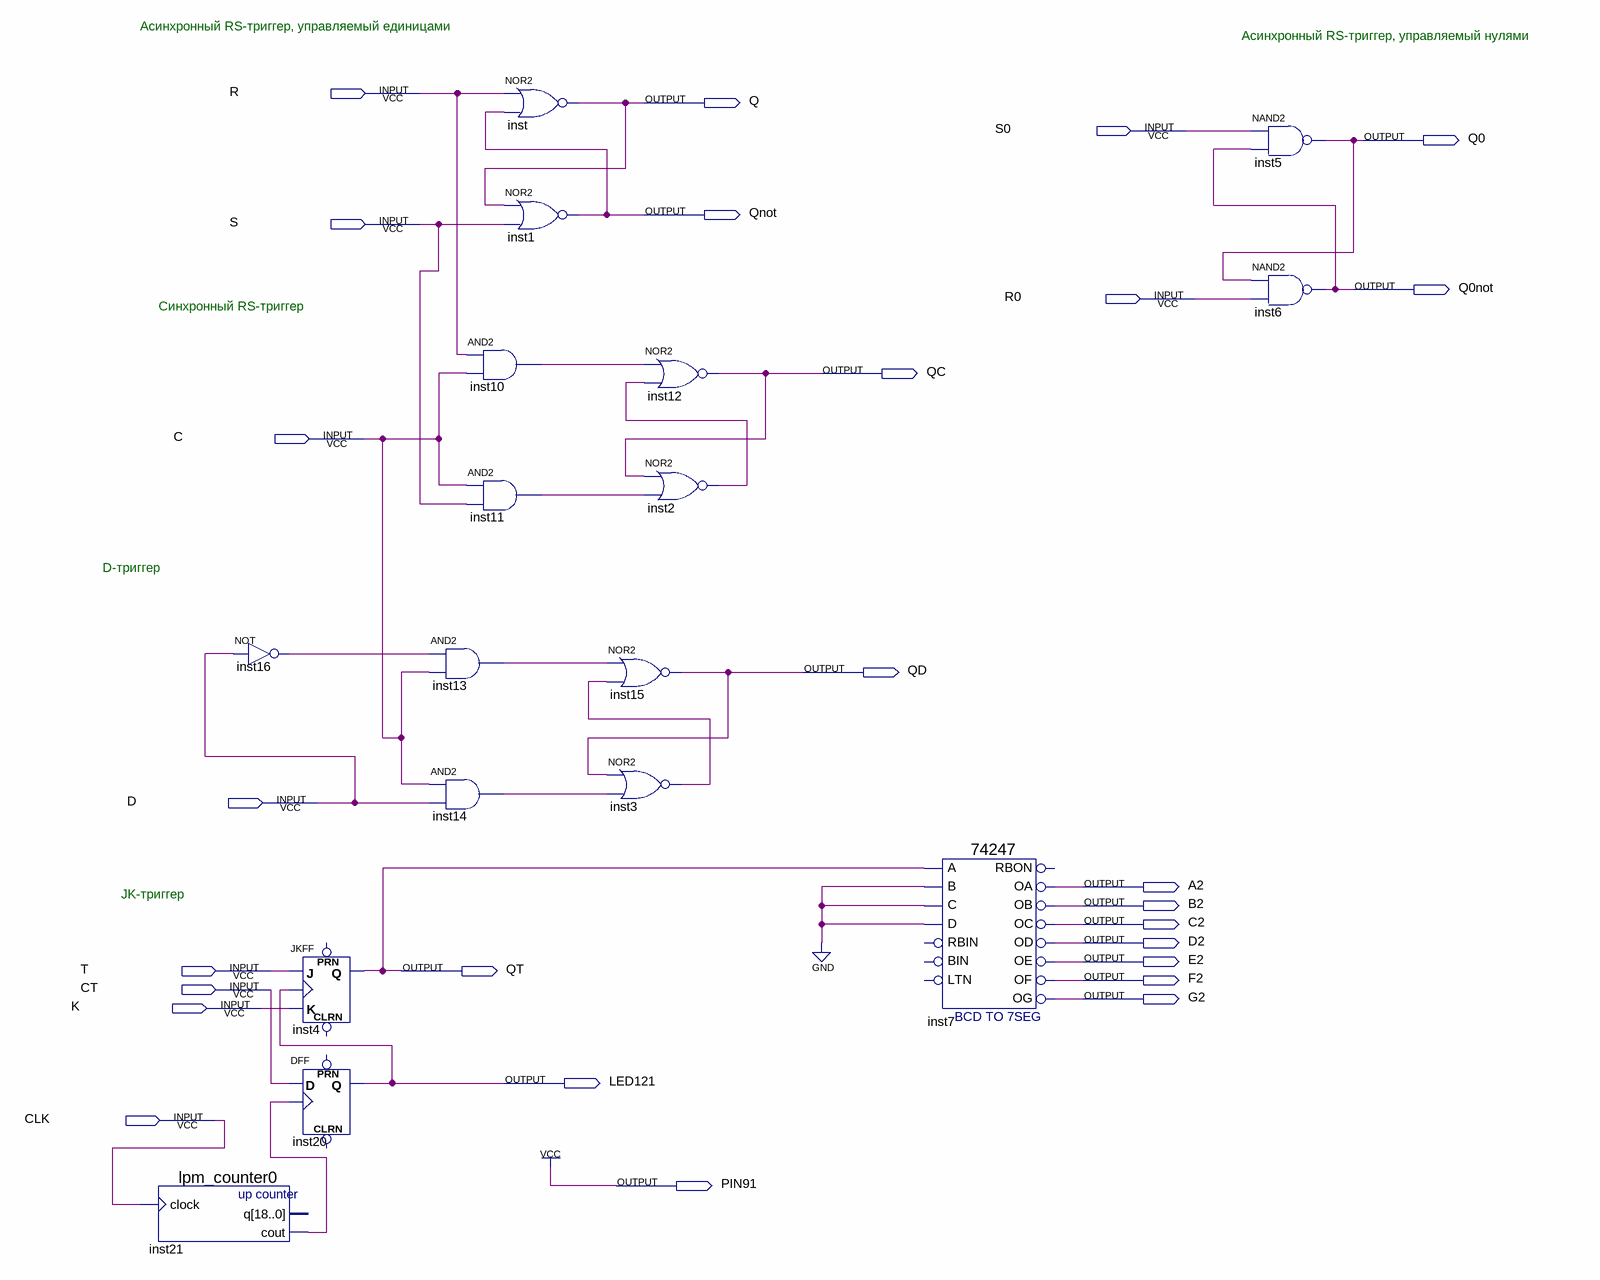
[diagram p0: schematic sheet]
// Quartus schematic Triggers.bdf as structural Verilog: 17 symbols, 26 pins
module Triggers (
  input  R,
  input  S0,
  input  S,
  input  R0,
  input  C,
  input  D,
  input  T,
  input  CT,
  input  K,
  input  CLK,
  output Q,
  output Q0,
  output Qnot,
  output Q0not,
  output QC,
  output QD,
  output A2,
  output B2,
  output C2,
  output D2,
  output E2,
  output QT,
  output F2,
  output G2,
  output LED121,
  output PIN91
);

  wire inst2_out, inst3_out, inst10_out, inst11_out, inst13_out, inst14_out, inst16_out, inst21_cout;

  lpm_counter0 inst21 (.clock(CLK), .cout(inst21_cout));  // open: q
  not inst16 (inst16_out, D);
  JKFF inst4 (.K(K), .J(T), .CLK(LED121), .Q(QT));  // open: PRN, CLRN
  DFF inst20 (.CLK(inst21_cout), .D(CT), .Q(LED121));  // open: CLRN, PRN
  and inst13 (inst13_out, inst16_out, C);
  and inst14 (inst14_out, C, D);
  nor inst (Q, R, Qnot);
  nor inst1 (Qnot, Q, S);
  and inst10 (inst10_out, R, C);
  and inst11 (inst11_out, C, S);
  nor inst12 (QC, inst10_out, inst2_out);
  nor inst2 (inst2_out, QC, inst11_out);
  nor inst15 (QD, inst13_out, inst3_out);
  nor inst3 (inst3_out, QD, inst14_out);
  \74247  inst7 (
    .A(QT), .B(1'b0), .C(1'b0), .D(1'b0), .OF(F2), .OC(C2), .OD(D2), .OE(E2), .OA(A2), .OB(B2), .OG(G2));  // open: LTN, BIN, RBIN, RBON
  nand inst5 (Q0, S0, Q0not);
  nand inst6 (Q0not, Q0, R0);

  assign PIN91 = 1'b1;

  // Notes on the sheet:
  //   Асинхронный RS-триггер, управляемый единицами
  //   Асинхронный RS-триггер, управляемый нулями
  //   Синхронный RS-триггер
  //   D-триггер
  //   JK-триггер
endmodule
